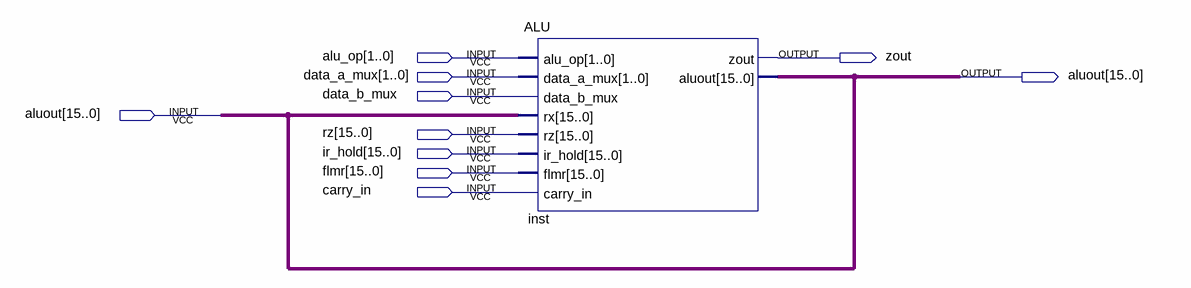
[diagram p0: schematic sheet]
// Quartus schematic test.bdf as structural Verilog: 1 symbols, 10 pins
module test (
  input  [1:0] alu_op,
  input  [1:0] data_a_mux,
  input  data_b_mux,
  inout  [15:0] aluout,
  input  [15:0] rz,
  input  [15:0] ir_hold,
  input  [15:0] flmr,
  input  carry_in,
  output zout
);

  ALU inst (
    .alu_op(alu_op), .data_a_mux(data_a_mux), .data_b_mux(data_b_mux), .rx(aluout), .rz(rz),
    .ir_hold(ir_hold), .flmr(flmr), .carry_in(carry_in), .zout(zout), .aluout(aluout));
endmodule
